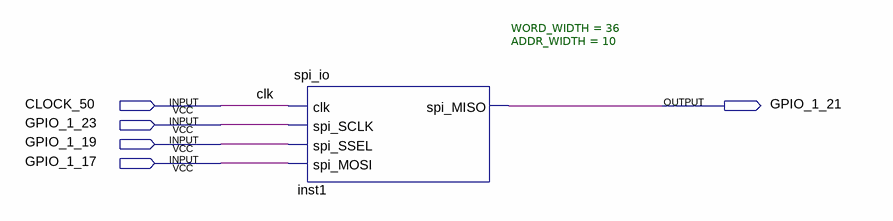
[diagram p0: schematic sheet]
// Quartus schematic spi.bdf as structural Verilog: 1 symbols, 5 pins
module spi (
  input  CLOCK_50,
  input  GPIO_1_23,
  input  GPIO_1_19,
  input  GPIO_1_17,
  output GPIO_1_21
);

  spi_io #(.WORD_WIDTH(36), .ADDR_WIDTH(10)) inst1 (
    .clk(CLOCK_50), .spi_SCLK(GPIO_1_23), .spi_SSEL(GPIO_1_19), .spi_MOSI(GPIO_1_17), .spi_MISO(GPIO_1_21));

  // Other names for the same wires on the sheet: clk = CLOCK_50
endmodule
